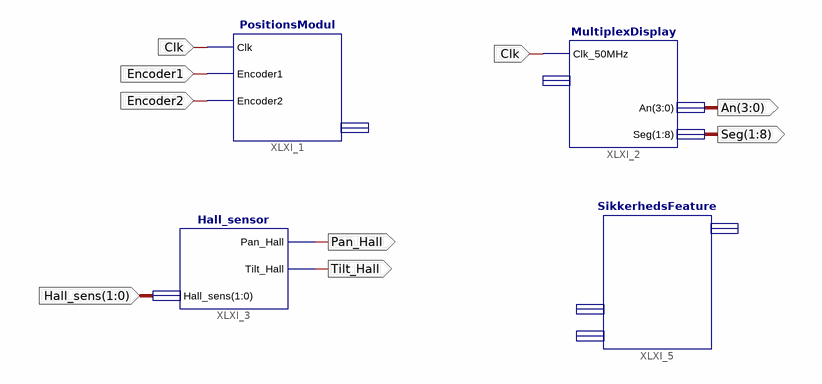
[diagram p0: schematic sheet 1]
// Xilinx ISE schematic Schematic_top_module.sch (spartan3e) as structural Verilog: 4 symbols, 8 ports
module Schematic_top_module (
  input  Clk,
  input  Encoder1,
  input  Encoder2,
  input  [1:0] Hall_sens,
  output [3:0] An,
  output [1:8] Seg,
  output Tilt_Hall,
  output Pan_Hall
);

  PositionsModul XLXI_1 (.Clk(Clk), .Encoder1(Encoder1), .Encoder2(Encoder2));  // open: Bcd
  MultiplexDisplay XLXI_2 (.Clk_50MHz(Clk), .Seg(Seg), .An(An));  // open: Bcd
  Hall_sensor XLXI_3 (.Pan_Hall(Pan_Hall), .Tilt_Hall(Tilt_Hall), .Hall_sens(Hall_sens));
  SikkerhedsFeature XLXI_5 ();  // open: Motor_Pan_Hall, Motor_Tilt_hall, Stop
endmodule
